# EAGLE schematic Compass (EAGLE 7.2.0)
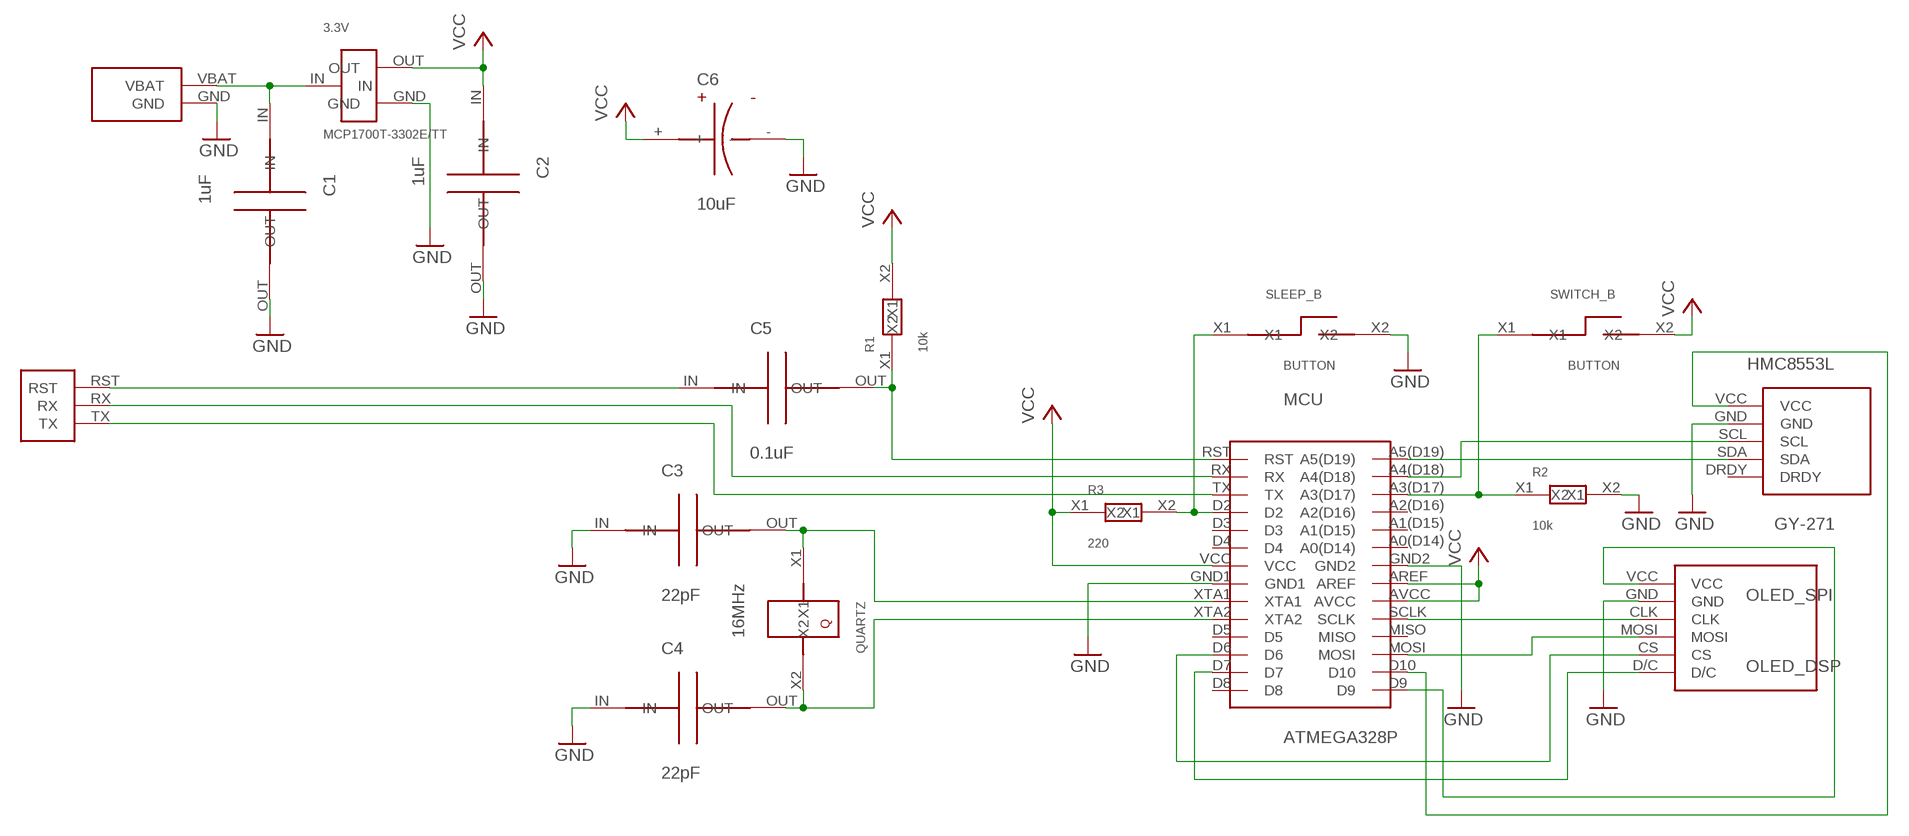
[diagram p0: schematic, sheet 1]

## Parts
3.3V  MCP1700T-3302E/TT  [MCP1700T-3302E/TT]
C1  1uF  C_CER_5MM  [C_CER_5MM]
C2  1uF  C_CER_5MM  [C_CER_5MM]
C3  22pF  C_CER_5MM  [C_CER_5MM]
C4  22pF  C_CER_5MM  [C_CER_5MM]
C5  0.1uF  C_CER_5MM  [C_CER_5MM]
C6  10uF  C_ELT_2MM  [C_ELT_2MM]
HMC8553L  GY-271  [GY-271]
MCU  ATMEGA328P  [DIP28]
OLED_SPI  OLED_DSP  [OLED_DSP]
QUARTZ  16MHz  Q_16  [Q_16]
R1  10k  R_6X2  [R_6X2]
R2  10k  R_6X2  [R_6X2]
R3  220  R_6X2  [R_6X2]
SLEEP_B  BUTTON  [BUTTON]
SWITCH_B  BUTTON  [BUTTON]
U$1  PROG_PLUG  [PROG_PLUG]
U$6  BAT_PLUG  [BAT_PLUG]

## Nets
GND: 3.3V.GND C1.OUT C2.OUT C3.IN C4.IN C6.- HMC8553L.GND MCU.GND1 MCU.GND2 OLED_SPI.GND R2.X2 SLEEP_B.X2 U$6.GND
N$1: MCU.SCLK OLED_SPI.CLK
N$2: MCU.MOSI OLED_SPI.MOSI
N$3: HMC8553L.SDA MCU.A5(D19)
N$4: HMC8553L.SCL MCU.A4(D18)
N$5: 3.3V.IN C1.IN U$6.VBAT
N$6: MCU.D9 OLED_SPI.VCC
N$7: C3.OUT MCU.XTA1 QUARTZ.X1
N$8: C4.OUT MCU.XTA2 QUARTZ.X2
N$9: MCU.D6 OLED_SPI.CS
N$10: MCU.D7 OLED_SPI.D/C
N$11: HMC8553L.VCC MCU.D10
N$13: C5.OUT MCU.RST R1.X1
N$14: MCU.D2 R3.X2 SLEEP_B.X1
N$15: MCU.A3(D17) R2.X1 SWITCH_B.X1
N$17: C5.IN U$1.RST
N$18: MCU.RX U$1.RX
N$19: MCU.TX U$1.TX
VCC: 3.3V.OUT C2.IN C6.+ MCU.AREF MCU.AVCC MCU.VCC R1.X2 R3.X1 SWITCH_B.X2
Unconnected: HMC8553L.DRDY MCU.A0(D14) MCU.A1(D15) MCU.A2(D16) MCU.D3 MCU.D4 MCU.D5 MCU.D8 MCU.MISO

## Library data of the parts
3.3V = MyDuino:MCP1700T-3302E/TT
C1-C5 = MyDuino:C_CER_5MM
C6 = MyDuino:C_ELT_2MM
HMC8553L = MyDuino:GY-271
MCU = MyDuino:ATMEGA328P
OLED_SPI = MyDuino:OLED_DSP
QUARTZ = MyDuino:Q_16
R1-R3 = MyDuino:R_6X2
SLEEP_B SWITCH_B = MyDuino:BUTTON
U$1 = MyDuino:PROG_PLUG
U$6 = MyDuino:BAT_PLUG